# Altium schematic sheet SHDN-CURRENT-S05-V00-CurrentInterface.SchDoc: Current Sensor Circuity
size A3; DrawnBy: Jonn Dillon; DocumentNumber: 4; SheetNumber: 4; SheetTotal: 14; Project: Shutdown Current Board 2020
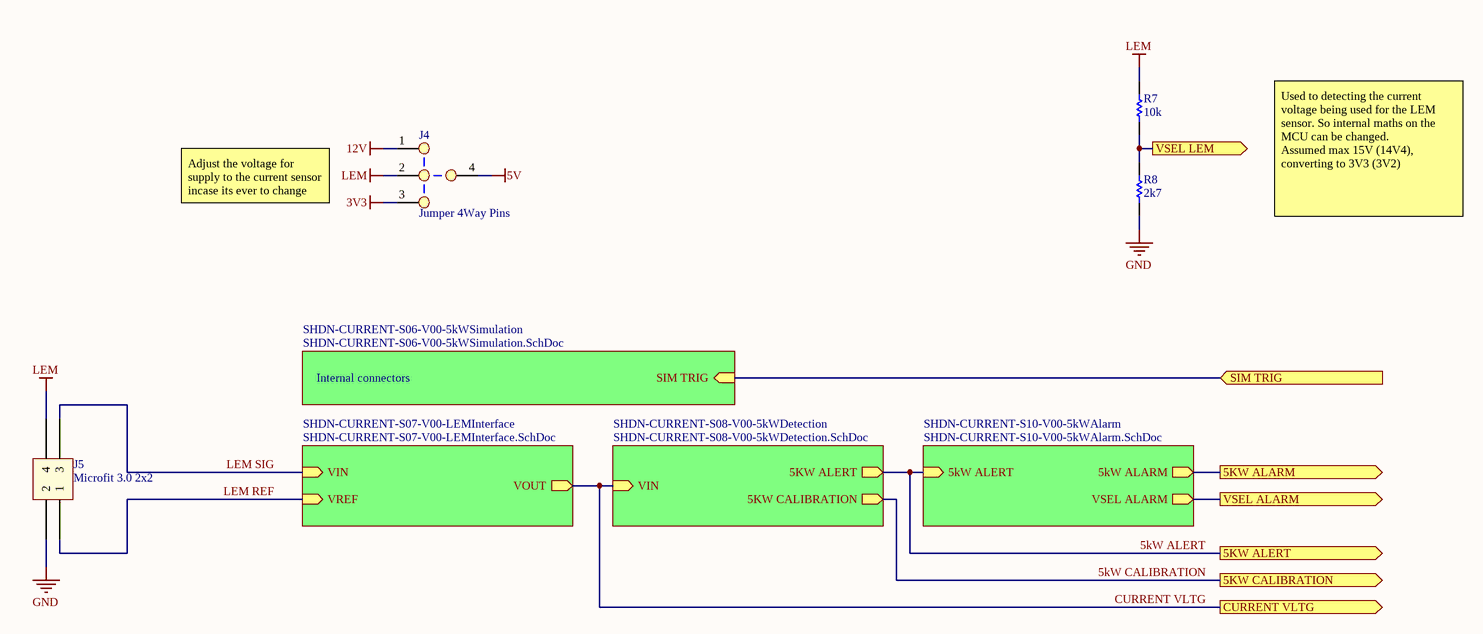
[diagram p0: SHDN-CURRENT-S05-V00-CurrentInterface.SchDoc]

## Parts
J4  Jumper 4Way Pins  [Jumper_4Way_Pin]
J5  Microfit 3.0 2x2  [Microfit_2X2_R_TH]
R7  10k  [Res_ThinFilm_0603]
R8  2k7  [Res_ThinFilm_0603]

## Sub-sheets
SHDN-CURRENT-S06-V00-5kWSimulation = SHDN-CURRENT-S06-V00-5kWSimulation.SchDoc: SIM TRIG (in)
SHDN-CURRENT-S07-V00-LEMInterface = SHDN-CURRENT-S07-V00-LEMInterface.SchDoc: VIN (in), VREF (in), VOUT (out)
SHDN-CURRENT-S08-V00-5kWDetection = SHDN-CURRENT-S08-V00-5kWDetection.SchDoc: 5KW ALERT (out), VIN (in), 5KW CALIBRATION (out)
SHDN-CURRENT-S10-V00-5kWAlarm = SHDN-CURRENT-S10-V00-5kWAlarm.SchDoc: 5kW ALARM (out), 5kW ALERT (in), VSEL ALARM (out)

## Ports
5KW ALARM (out), 5KW ALERT (out), 5KW CALIBRATION (out), CURRENT VLTG (out), SIM TRIG (in), VSEL ALARM (out), VSEL LEM (out)

## Nets
3V3: J4.3
5V: J4.4
12V: J4.1
GND: J5.2 R8.1
LEM: J4.2 J5.4 R7.2
5KW ALARM: port 5KW ALARM, sheet SHDN-CURRENT-S10-V00-5kWAlarm/5kW ALARM
5kW ALERT: port 5KW ALERT, sheet SHDN-CURRENT-S10-V00-5kWAlarm/5kW ALERT, sheet SHDN-CURRENT-S08-V00-5kWDetection/5KW ALERT
5kW CALIBRATION: port 5KW CALIBRATION, sheet SHDN-CURRENT-S08-V00-5kWDetection/5KW CALIBRATION
CURRENT VLTG: port CURRENT VLTG, sheet SHDN-CURRENT-S07-V00-LEMInterface/VOUT, sheet SHDN-CURRENT-S08-V00-5kWDetection/VIN
LEM REF: J5.1 ; sheet SHDN-CURRENT-S07-V00-LEMInterface/VREF
LEM SIG: J5.3 ; sheet SHDN-CURRENT-S07-V00-LEMInterface/VIN
SIM TRIG: port SIM TRIG, sheet SHDN-CURRENT-S06-V00-5kWSimulation/SIM TRIG
VSEL ALARM: port VSEL ALARM, sheet SHDN-CURRENT-S10-V00-5kWAlarm/VSEL ALARM
VSEL LEM: R7.1 R8.2 ; port VSEL LEM

## Notes on the sheet
- Adjust the voltage for supply to the current sensor incase its ever to change
- Used to detecting the current voltage being used for the LEM sensor. So internal maths on the MCU can be changed.
  Assumed max 15V (14V4), converting to 3V3 (3V2)
- Internal connectors
- Revision History:
- Sheet Title:
- Rev
- Date
- Description
- Project:
- Size:
- Drawn By:
- A3
- Number:
- Revision:
- Sheet
- Version:
- of
- QUT Motorsport
- O-120, Gardens Point
- 2 George Street
- Brisbane, QLD 4000
- Australia
- Print Date:
- Print Time:
- File Name:

## Library data of the parts
J5 = Microfit_2x2
R7 = 10k 5% 0603: Resistor, SMD, 10k, 0.1W, 5%, 0603
R8 = 2k7 5% 0603: Resistor, SMD, 2k7, 0.1W, 5%, 0603